# Altium project SeniorProject.PrjPCB
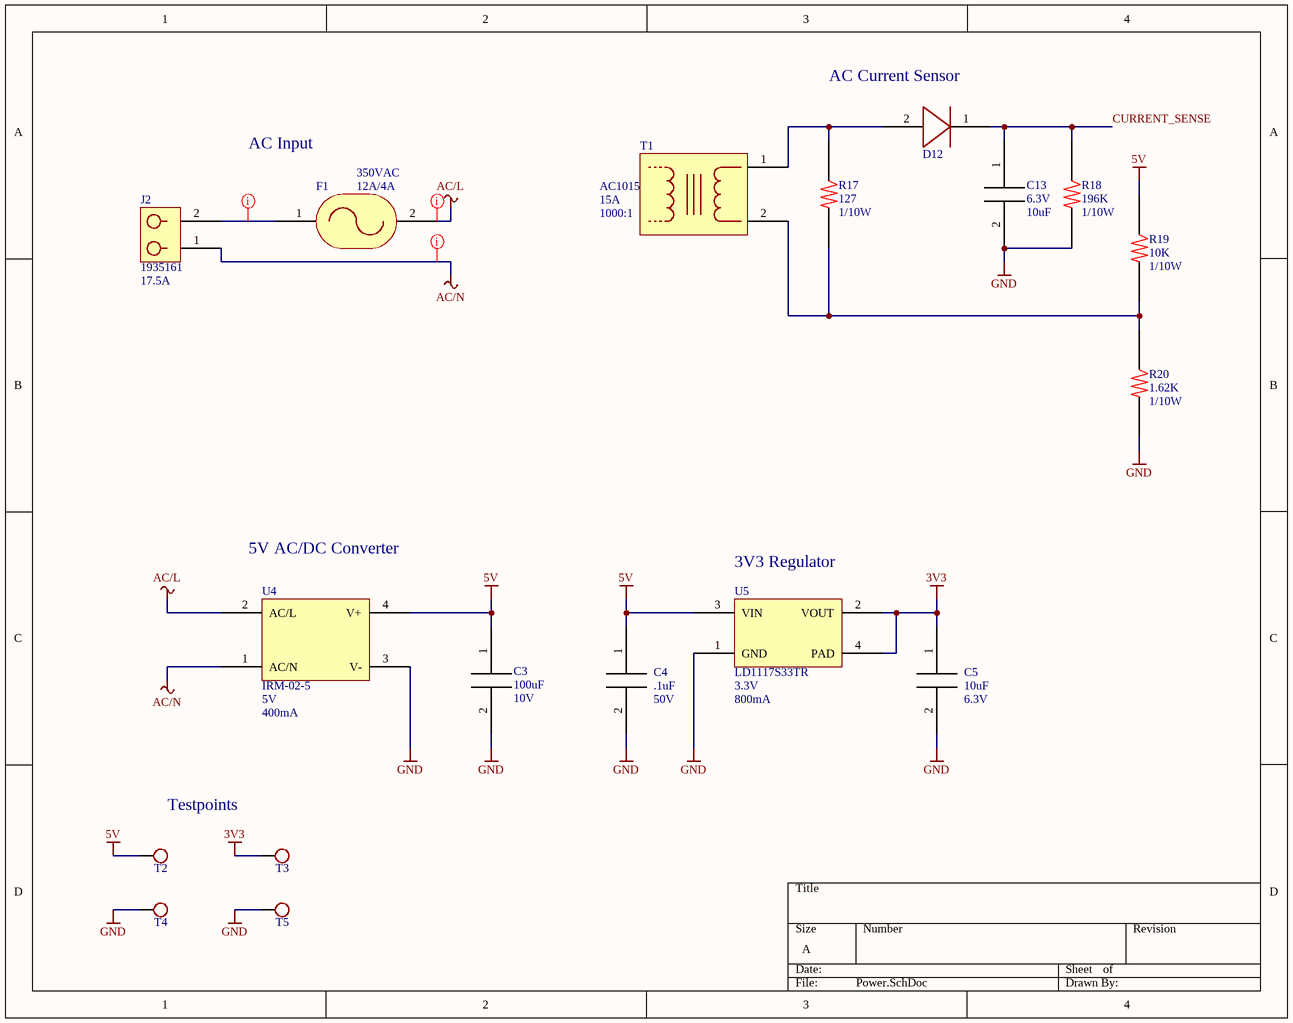
[diagram p0: Power.SchDoc]
4 sheets, 71 parts. Net scope: global (net labels, ports and power ports of the same name join across sheets).
Board file: LightSwitch.PcbDoc
Sheets:
  Power.SchDoc
  Dimmer.SchDoc
  XBee.SchDoc
  Logic.SchDoc

## Sheet Power.SchDoc
size A

### Parts
C3  value 100uF  Rating: 10V  [1210]  (hidden comment: C_CAP_1210)
C4  value .1uF  Rating: 50V  [0603]  (hidden comment: C_CAP_0603)
C5  value 10uF  Rating: 6.3V  [0603]  (hidden comment: C_CAP_0603)
C13  value 10uF  Rating: 6.3V  [0603]  (hidden comment: C_CAP_0603)
D12  D_DIODE_SOD123  [SOD123]  (value not drawn)
F1  value 12A/4A  Rating: 350VAC  [2410]  (hidden comment: F_FUSE_2410)
J2  Rating: 17.5A  [1935161]  (hidden comment: J_2POSTERM_1935161)
R17  value 127  Rating: 1/10W  [0603]  (hidden comment: R_RES_0603)
R18  value 196K  Rating: 1/10W  [0603]  (hidden comment: R_RES_0603)
R19  value 10K  Rating: 1/10W  [0603]  (hidden comment: R_RES_0603)
R20  value 1.62K  Rating: 1/10W  [0603]  (hidden comment: R_RES_0603)
T1  value 1000:1  Rating: 15A  [AC1015]  (hidden comment: T_CURRTRANS_AC1015)
T2  TESTPOINT  [TESTPOINT1MM]  (value not drawn)
T3  TESTPOINT  [TESTPOINT1MM]  (value not drawn)
T4  TESTPOINT  [TESTPOINT1MM]  (value not drawn)
T5  TESTPOINT  [TESTPOINT1MM]  (value not drawn)
U4  value 5V  Rating: 400mA  [IRM-02-5]  (hidden comment: U_IRM-02-5_IRM-02-5)
U5  value 3.3V  Rating: 800mA  PartNumber: LD1117S33TR  [SOT223]  (hidden comment: U_LD1117S33TR_SOT223)

### Nets
3V3: C5.1 T3.1 U5.2(VOUT) U5.4(PAD)
5V: C3.1 C4.1 R19.1 T2.1 U4.4(V+) U5.3(VIN)
AC/L: F1.2 U4.2(AC/L)
AC/N: J2.1 U4.1(AC/N)
GND: C3.2 C4.2 C5.2 C13.2 R18.2 R20.2 T4.1 T5.1 U4.3(V-) U5.1(GND)
CURRENT_SENSE: C13.1 D12.1 R18.1
NetD12_2: D12.2 R17.1 T1.1
NetF1_1: F1.1 J2.2
NetR17_2: R17.2 R19.2 R20.1 T1.2

### Layout directives
rule Width Constraint [Pref Width = 100mil    Min Width = 15mil    Max Width = 250mil]: AC/L, AC/N, NetF1_1

### Notes on the sheet
- (near D12) AC Current Sensor
- AC Input
- 5V AC/DC Converter
- (near U5) 3V3 Regulator
- Testpoints

### Library data of the parts
C3 = C_CAP_1210: PartNumber: GRM32ER61A107ME20L; Manufacturer: Murata
C5 C13 = C_CAP_0603: PartNumber: JMK107ABJ106MA-T; Manufacturer: Taiyo Yuden
D12 = D_DIODE_SOD123: PartNumber: BAS16GWJ; Manufacturer: Nexperia USA Inc; Rating: 215mA
F1 = F_FUSE_2410: PartNumber: 0679H9120-05/0679H4000-05; Manufacturer: Bel Fuse
J2 = J_2POSTERM_1935161: Manufacturer: Phoenix Contact; PartNumber: 1935161
R17 = R_RES_0603: PartNumber: RC0603FR-07127RL; Manufacturer: Yageo
R18 = R_RES_0603: PartNumber: RC0603FR-07196KL; Manufacturer: Yageo
R19 = R_RES_0603: PartNumber: RC0603JR-0710KL; Manufacturer: Yageo
R20 = R_RES_0603: PartNumber: RC0603FR-071K62L; Manufacturer: Yageo
T1 = T_CURRTRANS_AC1015: Manufacturer: Acme Electric/Amveco/Actown; PartNumber: AC1015
T2-T5 = T_TESTPOINT_TESTPOINT1MM: Value: 1mm
U4 = U_IRM-02-5_IRM-02-5: PartNumber: IRM-02-5

## Sheet Dimmer.SchDoc
size A4
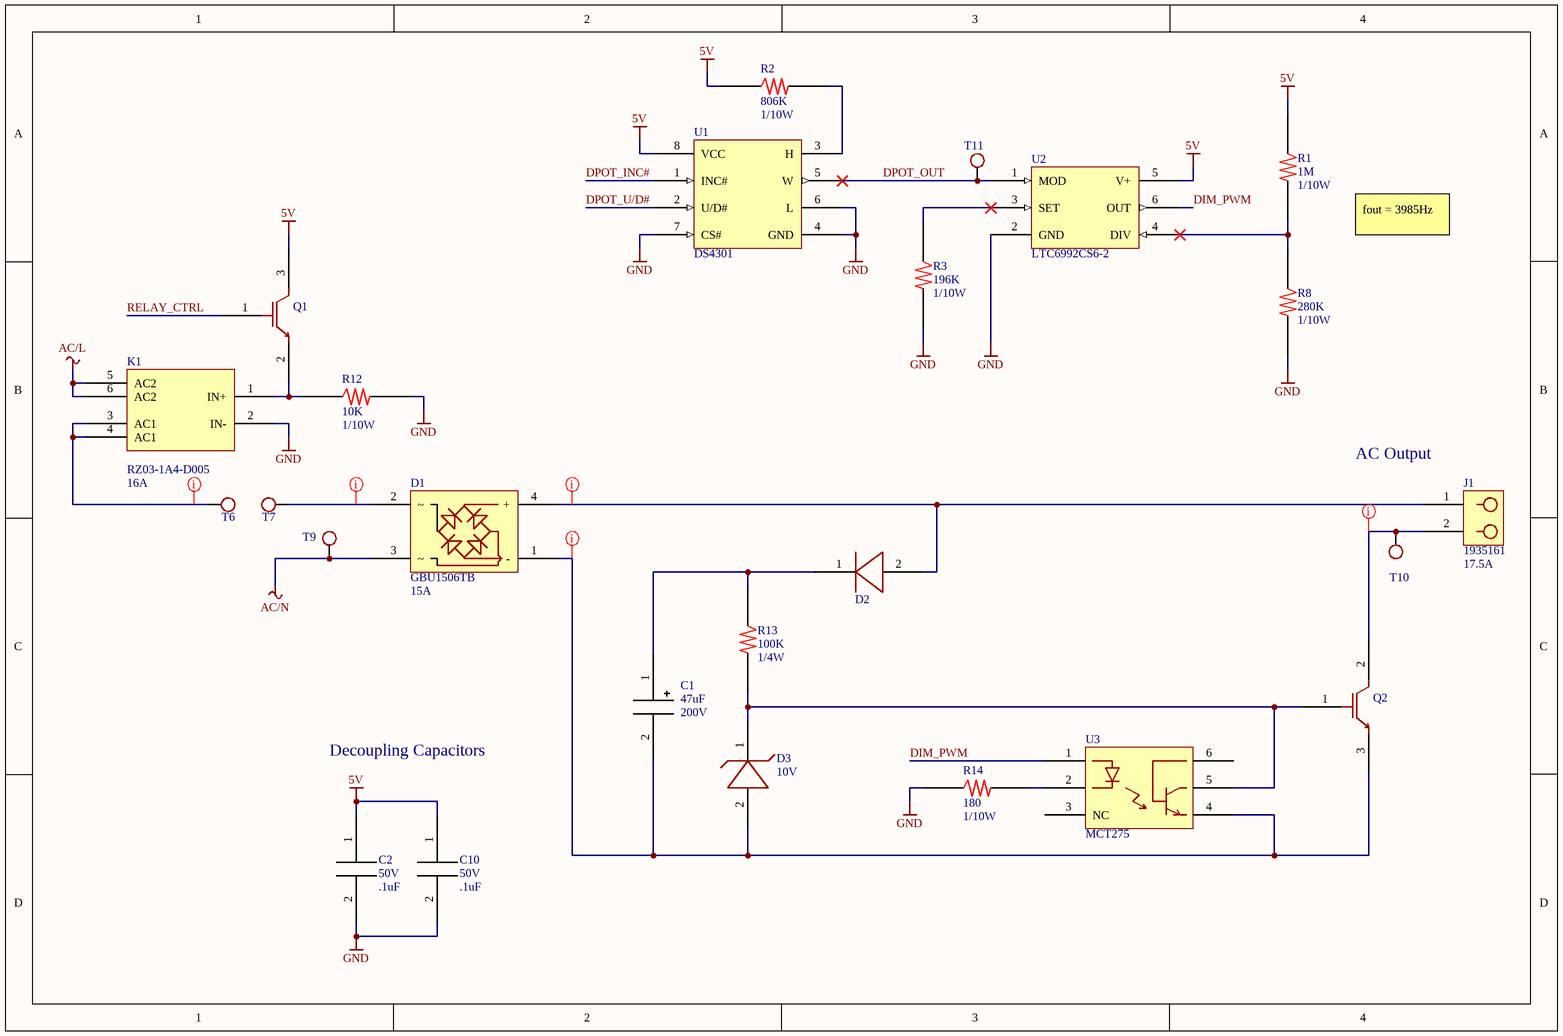
[diagram p1: Dimmer.SchDoc]

### Parts
C1  value 47uF  Rating: 200V  [CAP12.5X20]  (hidden comment: CAP)
C2  value .1uF  Rating: 50V  [0603]  (hidden comment: C_CAP_0603)
C10  value .1uF  Rating: 50V  [0603]  (hidden comment: C_CAP_0603)
D1  Rating: 15A  PartNumber: GBU1506TB  [GBU]  (hidden comment: D_RECTBRIDGE_GBU1506TB)
D2  D_DIODE_SOD123  [SOD123]  (value not drawn)
D3  value 10V  [SOD323]  (hidden comment: D_ZENER_SOD323)
J1  Rating: 17.5A  [1935161]  (hidden comment: J_2POSTERM_1935161)
K1  Rating: 16A  [RZ03-1A4-D005]  (hidden comment: K_RELAY-RZ03-1A4_RZ03-1A4-D005)
Q1  Q_NFET_SOT23  [SOT23]  (value not drawn)
Q2  Q_NFET_TO252  [TO252]  (value not drawn)
R1  value 1M  Rating: 1/10W  [0603]  (hidden comment: R_RES_0603)
R2  value 806K  Rating: 1/10W  [0603]  (hidden comment: R_RES_0603)
R3  value 196K  Rating: 1/10W  [0603]  (hidden comment: R_RES_0603)
R8  value 280K  Rating: 1/10W  [0603]  (hidden comment: R_RES_0603)
R12  value 10K  Rating: 1/10W  [0603]  (hidden comment: R_RES_0603)
R13  value 100K  Rating: 1/4W  [1206]  (hidden comment: R_RES_1206)
R14  value 180  Rating: 1/10W  [0603]  (hidden comment: R_RES_0603)
T6  TESTPOINT  [TESTPOINT3MM]  (value not drawn)
T7  TESTPOINT  [TESTPOINT3MM]  (value not drawn)
T9  TESTPOINT  [TESTPOINT3MM]  (value not drawn)
T10  TESTPOINT  [TESTPOINT3MM]  (value not drawn)
T11  TESTPOINT  [TESTPOINT1MM]  (value not drawn)
U1  PartNumber: DS4301  [MSOP8]  (hidden comment: U_DS4301_MSOP8)
U2  PartNumber: LTC6992CS6-2  [SOT23-6]  (hidden comment: U_LTC6992CS6-2_SOT23-6)
U3  PartNumber: MCT275  [DIP6]  (hidden comment: U_MCT275_DIP6)

### Nets
5V: C2.1 C10.1 Q1.3(D) R1.1 R2.1 U1.8(VCC) U2.5(V+)
AC/L: K1.5(AC2) K1.6(AC2)
AC/N: D1.3 T9.1
GND: C2.2 C10.2 K1.2(IN-) R3.2 R8.2 R12.2 R14.1 U1.4(GND) U1.6(L) U1.7(CS#) U2.2(GND)
DIM_PWM: U2.6(OUT) U3.1
DPOT_INC#: U1.1(INC#)
DPOT_OUT: T11.1 U1.5(W) U2.1(MOD)
DPOT_U/D#: U1.2(U/D#)
RELAY_CTRL: Q1.1(G)
NetC1_1: C1.1 D2.1 R13.1
NetC1_2: C1.2 D1.1(-) D3.2 Q2.3(S) U3.4
NetD1_2: D1.2 T7.1
NetD1_4: D1.4(+) D2.2 J1.1
NetD3_1: D3.1 Q2.1(G) R13.2 U3.5
NetJ1_2: J1.2 Q2.2(D) T10.1
NetK1_1: K1.1(IN+) Q1.2(S) R12.1
NetK1_3: K1.3(AC1) K1.4(AC1) T6.1
NetR1_2: R1.2 R8.1 U2.4(DIV)
NetR2_2: R2.2 U1.3(H)
NetR3_1: R3.1 U2.3(SET)
NetR14_2: R14.2 U3.2

Not connected (* = marked no-connect by the designer): U3 3(NC) 6

### Layout directives
rule Width Constraint [Pref Width = 100mil    Min Width = 100mil    Max Width = 250mil]: NetD1_2, NetK1_3
rule Width Constraint [Pref Width = 100mil    Min Width = 15mil    Max Width = 250mil]: NetC1_2, NetD1_4, NetJ1_2

### Notes on the sheet
- fout = 3985Hz
- (near J1) AC Output
- Decoupling Capacitors

### Library data of the parts
C1 = C_CAP-P_CAP12.5X20: PartNumber: UVR2D470MHD1TO; Manufacturer: Nichicon
C2 C10 = C_CAP_0603: PartNumber: C0603C104K5RACAUTO; Manufacturer: KEMET
D1 = D_RECTBRIDGE_GBU1506TB: Manufacturer: SMC Diode Solutions
D2 = D_DIODE_SOD123: as D12 on sheet Power
D3 = D_ZENER_SOD323: PartNumber: MM3Z10VT1G; Manufacturer: On Semiconductor; Rating: 300mW
J1 = J_2POSTERM_1935161: Manufacturer: Phoenix Contact; PartNumber: 1935161
K1 = K_RELAY-RZ03-1A4_RZ03-1A4-D005: Manufacturer: TE Connectivity / Potter and Brumfield; PartNumber: RZ03-1A4-D005
Q1 = Q_NFET_SOT23: Manufacturer: On Semiconductor; PartNumber: BSS138; Rating: 220mA
Q2 = Q_NFET_TO252: Manufacturer: Infineon Technologies; PartNumber: IPD50R280CEAUMA1; Rating: 18.1A
R1 = R_RES_0603: PartNumber: RC0603FR-071ML; Manufacturer: Yageo
R3 = R_RES_0603: as R18 on sheet Power
R8 = R_RES_0603: PartNumber: RC0603FR-07280KL; Manufacturer: Yageo
R12 = R_RES_0603: PartNumber: RC0603JR-0710KL
R13 = R_RES_1206: PartNumber: RC1206JR-07100KL; Manufacturer: Yageo
R14 = R_RES_0603: PartNumber: RC0603JR-07180RL; Manufacturer: Yageo
T6 T7 T9 T10 = T_TESTPOINT_TESTPOINT3MM: Value: 3mm
T11 = T_TESTPOINT_TESTPOINT1MM: Value: 1mm
U1 = U_DS4301_MSOP8: Manufacturer: Maxim; Value: 200K
U3 = U_MCT275_DIP6: Manufacturer: Vishay

## Sheet XBee.SchDoc
size A
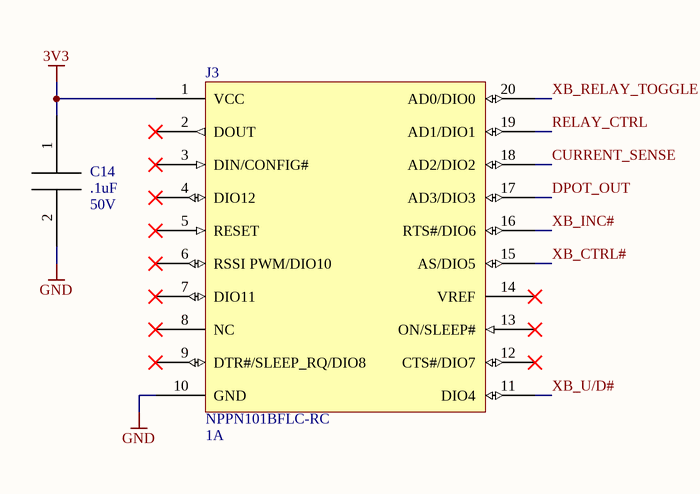
[diagram p2: XBee.SchDoc]

### Parts
C14  value .1uF  Rating: 50V  [0603]  (hidden comment: C_CAP_0603)
J3  Rating: 1A  [NPPN101BFLC-RC]  (hidden comment: J_XBEE_NPPN101BFLC-RC)

### Nets
3V3: C14.1 J3.1(VCC)
GND: C14.2 J3.10(GND)
CURRENT_SENSE: J3.18(AD2/DIO2)
DPOT_OUT: J3.17(AD3/DIO3)
RELAY_CTRL: J3.19(AD1/DIO1)
XB_CTRL#: J3.15(AS/DIO5)
XB_INC#: J3.16(RTS#/DIO6)
XB_RELAY_TOGGLE: J3.20(AD0/DIO0)
XB_U/D#: J3.11(DIO4)

Not connected (* = marked no-connect by the designer): J3 2(DOUT)* 3(DIN/CONFIG#)* 4(DIO12)* 5(RESET)* 6(RSSI_PWM/DIO10)* 7(DIO11)* 8(NC)* 9(DTR#/SLEEP_RQ/DIO8)* 12(CTS#/DIO7)* 13(ON/SLEEP#)* 14(VREF)*

### Library data of the parts
J3 = J_XBEE_NPPN101BFLC-RC: Manufacturer: Sullins Connector Solutions; PartNumber: NPPN101BFLC-RC

## Sheet Logic.SchDoc
size A4
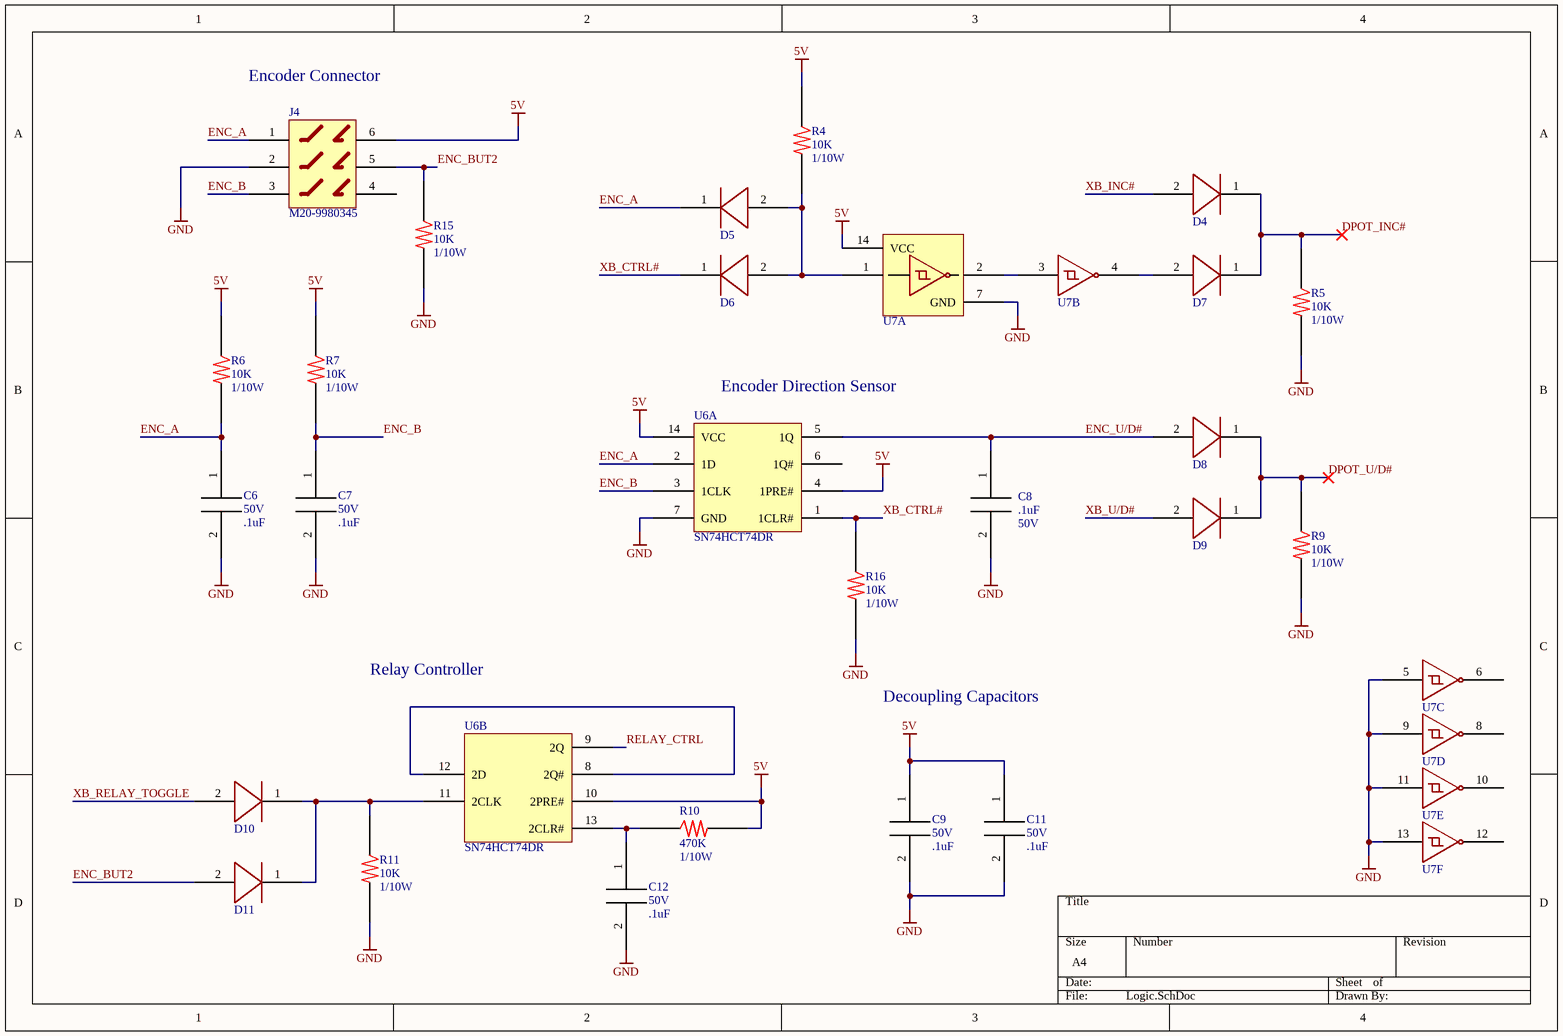
[diagram p3: Logic.SchDoc]

### Parts
C6  value .1uF  Rating: 50V  [0603]  (hidden comment: C_CAP_0603)
C7  value .1uF  Rating: 50V  [0603]  (hidden comment: C_CAP_0603)
C8  value .1uF  Rating: 50V  [0603]  (hidden comment: C_CAP_0603)
C9  value .1uF  Rating: 50V  [0603]  (hidden comment: C_CAP_0603)
C11  value .1uF  Rating: 50V  [0603]  (hidden comment: C_CAP_0603)
C12  value .1uF  Rating: 50V  [0603]  (hidden comment: C_CAP_0603)
D4  D_DIODE_SOD123  [SOD123]  (value not drawn)
D5  D_DIODE_SOD123  [SOD123]  (value not drawn)
D6  D_DIODE_SOD123  [SOD123]  (value not drawn)
D7  D_DIODE_SOD123  [SOD123]  (value not drawn)
D8  D_DIODE_SOD123  [SOD123]  (value not drawn)
D9  D_DIODE_SOD123  [SOD123]  (value not drawn)
D10  D_DIODE_SOD123  [SOD123]  (value not drawn)
D11  D_DIODE_SOD123  [SOD123]  (value not drawn)
J4  J_6POSM_M20-9980345  [M20-9980345]  (value not drawn)
R4  value 10K  Rating: 1/10W  [0603]  (hidden comment: R_RES_0603)
R5  value 10K  Rating: 1/10W  [0603]  (hidden comment: R_RES_0603)
R6  value 10K  Rating: 1/10W  [0603]  (hidden comment: R_RES_0603)
R7  value 10K  Rating: 1/10W  [0603]  (hidden comment: R_RES_0603)
R9  value 10K  Rating: 1/10W  [0603]  (hidden comment: R_RES_0603)
R10  value 470K  Rating: 1/10W  [0603]  (hidden comment: R_RES_0603)
R11  value 10K  Rating: 1/10W  [0603]  (hidden comment: R_RES_0603)
R15  value 10K  Rating: 1/10W  [0603]  (hidden comment: R_RES_0603)
R16  value 10K  Rating: 1/10W  [0603]  (hidden comment: R_RES_0603)
U6  PartNumber: SN74HCT74DR  [SOIC14]  (hidden comment: U_DUALDFLIP_SOIC14)  (parts A,B of 2)
U7  U_SN74HCT04DR_SOIC14  [SOIC14]  (value not drawn)  (parts A,B,C,D,E,F of 6)

### Nets
5V: C9.1 C11.1 J4.6 R4.1 R6.1 R7.1 R10.2 U6.4(1PRE#) U6.10(2PRE#) U6.14(VCC) U7.14(VCC)
GND: C6.2 C7.2 C8.2 C9.2 C11.2 C12.2 J4.2 R5.2 R9.2 R11.2 R15.2 R16.2 U6.7(GND) U7.5 U7.7(GND) U7.9 U7.11 U7.13
DPOT_INC#: D4.1 D7.1 R5.1
DPOT_U/D#: D8.1 D9.1 R9.1
ENC_A: C6.1 D5.1 J4.1 R6.2 U6.2(1D)
ENC_B: C7.1 J4.3 R7.2 U6.3(1CLK)
ENC_BUT2: D11.2 J4.5 R15.1
ENC_U/D#: C8.1 D8.2 U6.5(1Q)
RELAY_CTRL: U6.9(2Q)
XB_CTRL#: D6.1 R16.1 U6.1(1CLR#)
XB_INC#: D4.2
XB_RELAY_TOGGLE: D10.2
XB_U/D#: D9.2
NetC12_1: C12.1 R10.1 U6.13(2CLR#)
NetD5_2: D5.2 D6.2 R4.2 U7.1
NetD7_2: D7.2 U7.4
NetD10_1: D10.1 D11.1 R11.1 U6.11(2CLK)
NetU6_8: U6.8(2Q#) U6.12(2D)
NetU7_2: U7.2 U7.3

Not connected (* = marked no-connect by the designer): J4 4; U6 6(1Q#); U7 6 8 10 12

### Notes on the sheet
- Encoder Connector
- (near U6) Encoder Direction Sensor
- Relay Controller
- Decoupling Capacitors

### Library data of the parts
C6-C9 C11 C12 = C_CAP_0603: as C2 on sheet Dimmer
D4-D11 = D_DIODE_SOD123: as D12 on sheet Power
J4 = J_6POSM_M20-9980345: Manufacturer: Harwin; Rating: 3A; PartNumber: M20-9980345
R4-R7 R9 R11 R15 R16 = R_RES_0603: PartNumber: RC0603JR-0710KL
R10 = R_RES_0603: PartNumber: RC0603JR-07470KL; Manufacturer: Yageo
U6 = U_DUALDFLIP_SOIC14: Manufacturer: TI
U7 = U_SN74HCT04DR_SOIC14: Manufacturer: TI; PartNumber: SN74HCT04DR

## Nets that join several sheets
3V3: Power (C5.1 T3.1 U5.2 U5.4), XBee (C14.1 J3.1)
5V: Power (6 pins), Dimmer (7 pins), Logic (11 pins)
AC/L: Power (F1.2 U4.2), Dimmer (K1.5 K1.6)
AC/N: Power (J2.1 U4.1), Dimmer (D1.3 T9.1)
GND: Power (10 pins), Dimmer (11 pins), XBee (C14.2 J3.10), Logic (18 pins)
CURRENT_SENSE: Power (C13.1 D12.1 R18.1), XBee (J3.18)
DPOT_INC#: Dimmer (U1.1), Logic (D4.1 D7.1 R5.1)
DPOT_OUT: Dimmer (T11.1 U1.5 U2.1), XBee (J3.17)
DPOT_U/D#: Dimmer (U1.2), Logic (D8.1 D9.1 R9.1)
RELAY_CTRL: Dimmer (Q1.1), XBee (J3.19), Logic (U6.9)
XB_CTRL#: XBee (J3.15), Logic (D6.1 R16.1 U6.1)
XB_INC#: XBee (J3.16), Logic (D4.2)
XB_RELAY_TOGGLE: XBee (J3.20), Logic (D10.2)
XB_U/D#: XBee (J3.11), Logic (D9.2)